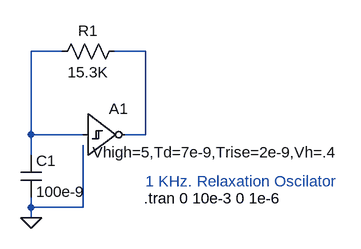
[diagram p0: schematic 1KHZRELAX.asc]
1KHZRELAX.asc, the LTspice schematic file:
Version 4
SHEET 1 880 680
WIRE 64 304 64 320
WIRE 64 240 64 208
WIRE 64 80 112 80
WIRE 144 320 64 320
WIRE 64 320 64 336
WIRE 240 208 240 80
WIRE 240 80 192 80
WIRE 208 208 240 208
WIRE 144 224 144 320
WIRE 144 208 64 208
WIRE 64 208 64 80
FLAG 64 336 0
SYMBOL res 208 64 R90
WINDOW 0 0 56 VBottom 0
WINDOW 3 32 56 VTop 0
SYMATTR InstName R1
SYMATTR Value 15.3K
SYMATTR SpiceLine tol=1 pwr=0.1
SYMBOL cap 48 240 R0
SYMATTR InstName C1
SYMATTR Value 100e-9
SYMBOL Digital\\schmtinv 144 144 R0
WINDOW 3 15 91 Left 0
SYMATTR InstName A1
SYMATTR Value Vhigh=5,Td=7e-9,Trise=2e-9,Vh=.4
TEXT 238 306 Left 0 !.tran 0 10e-3 0 1e-6
TEXT 240 280 Left 0 ;1 KHz. Relaxation Oscilator

The netlist it stands for:
* 1KHZRELAX.asc
R1 N002 N001 15.3K tol=1 pwr=0.1
C1 N001 0 100e-9
A1 N001 0 0 0 0 N002 0 0 SCHMITT Vhigh=5,Td=7e-9,Trise=2e-9,Vh=.4
.tran 0 10e-3 0 1e-6
* 1 KHz. Relaxation Oscilator
.backanno
.end